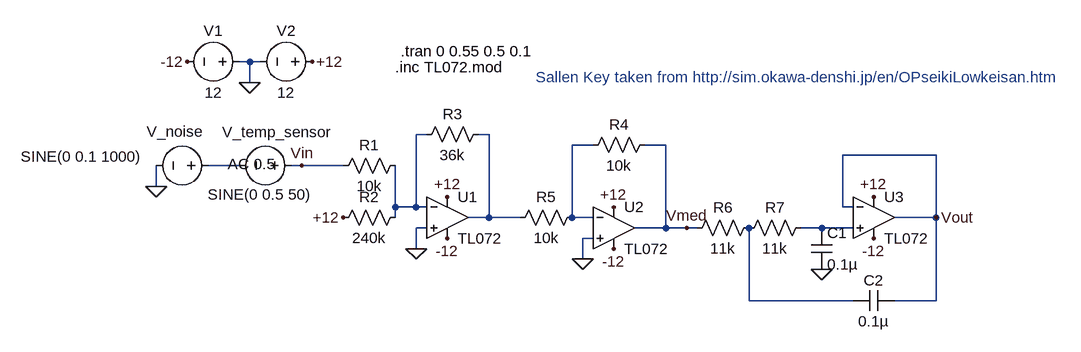
[diagram p0: schematic Draft.asc]
Draft.asc, the LTspice schematic file:
Version 4
SHEET 1 1648 680
WIRE -64 -80 -80 -80
WIRE -48 -80 -64 -80
WIRE -64 -48 -64 -80
WIRE 208 32 192 32
WIRE 304 32 288 32
WIRE 464 48 432 48
WIRE 576 48 544 48
WIRE 992 64 848 64
WIRE -80 80 -128 80
WIRE 16 80 0 80
WIRE 80 80 16 80
WIRE -208 112 -208 80
WIRE 160 144 160 80
WIRE 192 144 192 32
WIRE 192 144 160 144
WIRE 208 144 192 144
WIRE 848 144 848 64
WIRE 864 144 848 144
WIRE 160 160 160 144
WIRE 304 160 304 32
WIRE 304 160 272 160
WIRE 352 160 304 160
WIRE 432 160 432 48
WIRE 464 160 432 160
WIRE 992 160 992 64
WIRE 992 160 928 160
WIRE 208 176 192 176
WIRE 576 176 576 48
WIRE 576 176 528 176
WIRE 608 176 576 176
WIRE 624 176 608 176
WIRE 816 176 784 176
WIRE 864 176 816 176
WIRE 464 192 448 192
WIRE 192 208 192 176
WIRE 448 224 448 192
WIRE 704 288 704 176
WIRE 864 288 704 288
WIRE 992 288 992 160
WIRE 992 288 928 288
FLAG -64 -48 0
FLAG 32 -80 +12
FLAG -160 -80 -12
FLAG 240 192 -12
FLAG 240 128 +12
FLAG 192 208 0
FLAG 80 160 +12
FLAG 16 80 Vin
FLAG 496 208 -12
FLAG 496 144 +12
FLAG 448 224 0
FLAG 896 192 -12
FLAG 896 128 +12
FLAG 816 240 0
FLAG 992 160 Vout
FLAG 608 176 Vmed
FLAG -208 112 0
SYMBOL Opamps\\opamp2 240 96 R0
SYMATTR InstName U1
SYMATTR Value TL072
SYMBOL voltage -64 -80 R90
WINDOW 0 -32 56 VBottom 2
WINDOW 3 32 56 VTop 2
WINDOW 123 0 0 Left 0
WINDOW 39 0 0 Left 0
SYMATTR InstName V1
SYMATTR Value 12
SYMBOL voltage 48 -80 R90
WINDOW 0 -32 56 VBottom 2
WINDOW 3 32 56 VTop 2
WINDOW 123 0 0 Left 0
WINDOW 39 0 0 Left 0
SYMATTR InstName V2
SYMATTR Value 12
SYMBOL res 176 64 R90
WINDOW 0 0 56 VBottom 2
WINDOW 3 32 56 VTop 2
SYMATTR InstName R1
SYMATTR Value 10k
SYMBOL res 176 144 R90
WINDOW 0 0 56 VBottom 2
WINDOW 3 32 56 VTop 2
SYMATTR InstName R2
SYMATTR Value 240k
SYMBOL res 304 16 R90
WINDOW 0 0 56 VBottom 2
WINDOW 3 32 56 VTop 2
SYMATTR InstName R3
SYMATTR Value 36k
SYMBOL voltage 16 80 R90
WINDOW 0 -36 38 VBottom 2
WINDOW 3 60 65 VBottom 2
WINDOW 123 13 77 VBottom 2
WINDOW 39 0 0 Left 0
SYMATTR InstName V_temp_sensor
SYMATTR Value SINE(0 0.5 50)
SYMATTR Value2 AC 0.5
SYMBOL Opamps\\opamp2 496 112 R0
SYMATTR InstName U2
SYMATTR Value TL072
SYMBOL res 560 32 R90
WINDOW 0 0 56 VBottom 2
WINDOW 3 32 56 VTop 2
SYMATTR InstName R4
SYMATTR Value 10k
SYMBOL res 448 144 R90
WINDOW 0 0 56 VBottom 2
WINDOW 3 32 56 VTop 2
SYMATTR InstName R5
SYMATTR Value 10k
SYMBOL Opamps\\opamp2 896 96 R0
SYMATTR InstName U3
SYMATTR Value TL072
SYMBOL res 800 160 R90
WINDOW 0 0 56 VBottom 2
WINDOW 3 32 56 VTop 2
SYMATTR InstName R7
SYMATTR Value 11k
SYMBOL res 720 160 R90
WINDOW 0 0 56 VBottom 2
WINDOW 3 32 56 VTop 2
SYMATTR InstName R6
SYMATTR Value 11k
SYMBOL cap 800 176 R0
SYMATTR InstName C1
SYMATTR Value 0.1µ
SYMBOL cap 928 272 R90
WINDOW 0 0 32 VBottom 2
WINDOW 3 32 32 VTop 2
SYMATTR InstName C2
SYMATTR Value 0.1µ
SYMBOL voltage -112 80 R90
WINDOW 0 -37 67 VBottom 2
WINDOW 3 -30 211 VTop 2
WINDOW 123 0 0 Left 0
WINDOW 39 0 0 Left 0
SYMATTR InstName V_noise
SYMATTR Value SINE(0 0.1 1000)
TEXT 168 -96 Left 2 !.tran 0 0.55 0.5 0.1
TEXT 160 -72 Left 2 !.inc TL072.mod
TEXT 376 -56 Left 2 ;Sallen Key taken from http://sim.okawa-denshi.jp/en/OPseikiLowkeisan.htm

The netlist it stands for:
* Draft.asc
XU1 0 N001 +12 -12 N002 TL072  ; pins In+ In- V+ V- OUT
V1 0 -12 12
V2 +12 0 12
R1 N001 Vin 10k
R2 N001 +12 240k
R3 N002 N001 36k
V_temp_sensor Vin N004 SINE(0 0.5 50) AC 0.5
XU2 0 N003 +12 -12 Vmed TL072  ; pins In+ In- V+ V- OUT
R4 Vmed N003 10k
R5 N003 N002 10k
XU3 N005 Vout +12 -12 Vout TL072  ; pins In+ In- V+ V- OUT
R7 N005 N006 11k
R6 N006 Vmed 11k
C1 N005 0 0.1µ
C2 Vout N006 0.1µ
V_noise N004 0 SINE(0 0.1 1000)
.tran 0 0.55 0.5 0.1
.inc TL072.mod
* Sallen Key taken from http://sim.okawa-denshi.jp/en/OPseikiLowkeisan.htm
.backanno
.end

* Results of the author's LTspice run, read from the files saved beside the schematic
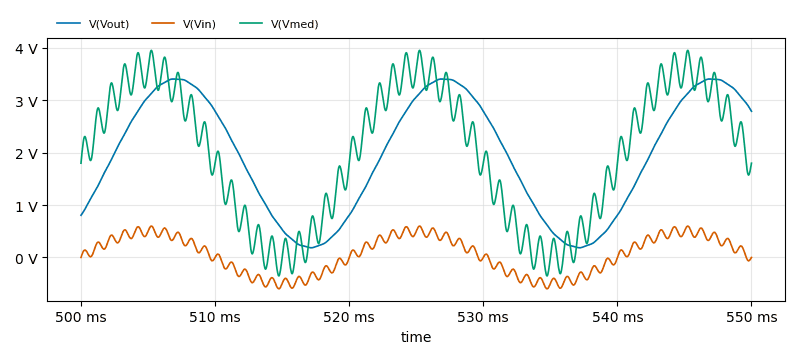
[diagram p1: Transient Analysis of Draft.asc, plotted from the saved traces]
* Transient Analysis, 1 run:
*   V(Vout): min 185.1 mV, max 3.406 V, average 1.961 V, rms 2.261 V, last 2.791 V
*   V(Vin): min -598.4 mV, max 598.5 mV, average 63.65 mV, rms 360.8 mV, last 0 V
*   V(Vmed): min -352.4 mV, max 3.953 V, average 2.029 V, rms 2.398 V, last 1.799 V